# Altium schematic sheet IGresupply.SchDoc
size A3
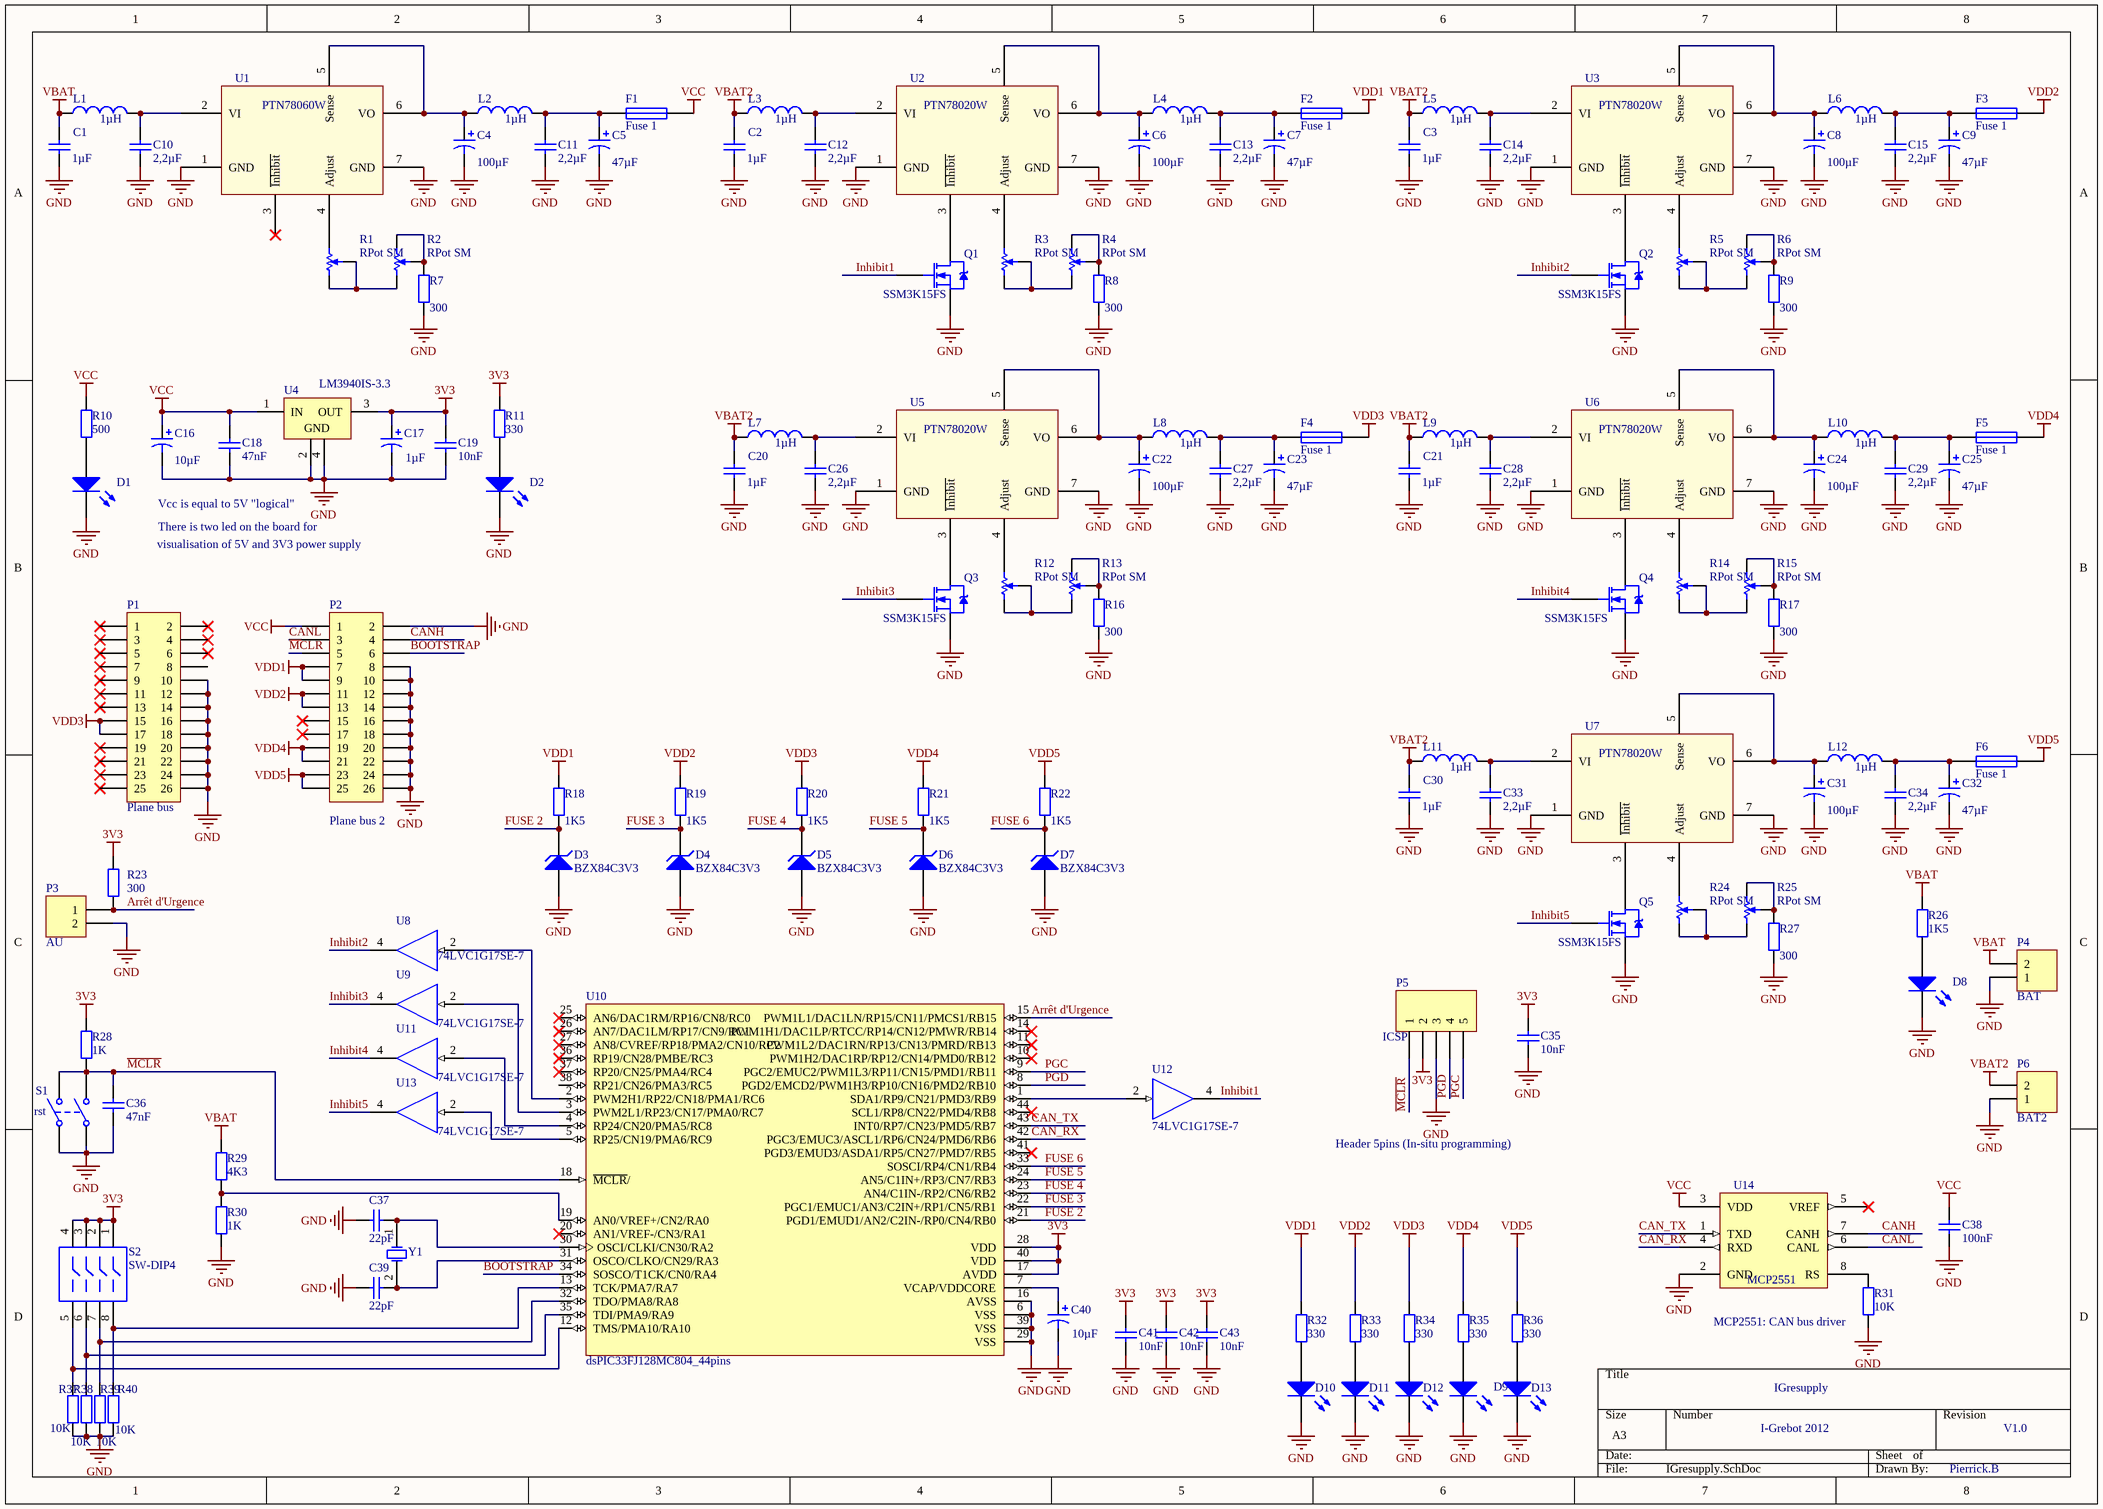
[diagram p0: IGresupply.SchDoc]

## Parts
C1  value 1µF  [Boitier tantale A]  (hidden comment: Cap)
C2  value 1µF  [Boitier tantale A]  (hidden comment: Cap)
C3  value 1µF  [Boitier tantale A]  (hidden comment: Cap)
C4  value 100µF  [Boitier tantale C]  (hidden comment: Cap Pol)
C5  value 47µF  [Boitier tantale C]  (hidden comment: Cap Pol)
C6  value 100µF  [Boitier tantale C]  (hidden comment: Cap Pol)
C7  value 47µF  [Boitier tantale C]  (hidden comment: Cap Pol)
C8  value 100µF  [Boitier tantale C]  (hidden comment: Cap Pol)
C9  value 47µF  [Boitier tantale C]  (hidden comment: Cap Pol)
C10  value 2,2µF  [Boitier tantale A]  (hidden comment: Cap)
C11  value 2,2µF  [Boitier tantale A]  (hidden comment: Cap)
C12  value 2,2µF  [Boitier tantale A]  (hidden comment: Cap)
C13  value 2,2µF  [Boitier tantale A]  (hidden comment: Cap)
C14  value 2,2µF  [Boitier tantale A]  (hidden comment: Cap)
C15  value 2,2µF  [Boitier tantale A]  (hidden comment: Cap)
C16  value 10µF  [Boitier tantale A]  (hidden comment: Cap Pol)
C17  value 1µF  [Boitier tantale A]  (hidden comment: Cap Pol)
C18  value 47nF  [C0603]  (hidden comment: Cap)
C19  value 10nF  [C0603]  (hidden comment: Cap)
C20  value 1µF  [Boitier tantale A]  (hidden comment: Cap)
C21  value 1µF  [Boitier tantale A]  (hidden comment: Cap)
C22  value 100µF  [Boitier tantale C]  (hidden comment: Cap Pol)
C23  value 47µF  [Boitier tantale C]  (hidden comment: Cap Pol)
C24  value 100µF  [Boitier tantale C]  (hidden comment: Cap Pol)
C25  value 47µF  [Boitier tantale C]  (hidden comment: Cap Pol)
C26  value 2,2µF  [Boitier tantale A]  (hidden comment: Cap)
C27  value 2,2µF  [Boitier tantale A]  (hidden comment: Cap)
C28  value 2,2µF  [Boitier tantale A]  (hidden comment: Cap)
C29  value 2,2µF  [Boitier tantale A]  (hidden comment: Cap)
C30  value 1µF  [Boitier tantale A]  (hidden comment: Cap)
C31  value 100µF  [Boitier tantale C]  (hidden comment: Cap Pol)
C32  value 47µF  [Boitier tantale C]  (hidden comment: Cap Pol)
C33  value 2,2µF  [Boitier tantale A]  (hidden comment: Cap)
C34  value 2,2µF  [Boitier tantale A]  (hidden comment: Cap)
C35  value 10nF  [C0603]  (hidden comment: Cap)
C36  value 47nF  [C0603]  (hidden comment: Cap)
C37  value 22pF  [C0603]  (hidden comment: Cap)
C38  value 100nF  [C0603]  (hidden comment: Cap)
C39  value 22pF  [C0603]  (hidden comment: Cap)
C40  value 10µF  [Boitier tantale A]  (hidden comment: Cap Pol)
C41  value 10nF  [C0603]  (hidden comment: Cap)
C42  value 10nF  [C0603]  (hidden comment: Cap)
C43  value 10nF  [C0603]  (hidden comment: Cap)
D1  LED1  [HSMS-C110]  (value not drawn)
D2  LED1  [HSMS-C110]  (value not drawn)
D3  BZX84C3V3  [SOT-23]
D4  BZX84C3V3  [SOT-23]
D5  BZX84C3V3  [SOT-23]
D6  BZX84C3V3  [SOT-23]
D7  BZX84C3V3  [SOT-23]
D8  LED1  [HSMS-C110]  (value not drawn)
D9  LED1  [HSMS-C110]  (value not drawn)
D10  LED1  [HSMS-C110]  (value not drawn)
D11  LED1  [HSMS-C110]  (value not drawn)
D12  LED1  [HSMS-C110]  (value not drawn)
D13  LED1  [HSMS-C110]  (value not drawn)
F1  Fuse 1  [MCCQ-122]
F2  Fuse 1  [MCCQ-122]
F3  Fuse 1  [MCCQ-122]
F4  Fuse 1  [MCCQ-122]
F5  Fuse 1  [MCCQ-122]
F6  Fuse 1  [MCCQ-122]
L1  value 1µH  [744772010]  (hidden comment: Inductor)
L2  value 1µH  [744772010]  (hidden comment: Inductor)
L3  value 1µH  [744772010]  (hidden comment: Inductor)
L4  value 1µH  [744772010]  (hidden comment: Inductor)
L5  value 1µH  [744772010]  (hidden comment: Inductor)
L6  value 1µH  [744772010]  (hidden comment: Inductor)
L7  value 1µH  [744772010]  (hidden comment: Inductor)
L8  value 1µH  [744772010]  (hidden comment: Inductor)
L9  value 1µH  [744772010]  (hidden comment: Inductor)
L10  value 1µH  [744772010]  (hidden comment: Inductor)
L11  value 1µH  [744772010]  (hidden comment: Inductor)
L12  value 1µH  [744772010]  (hidden comment: Inductor)
P1  Plane bus  [HDR2X13H]
P2  Plane bus 2  [HDR2X13H]
P3  AU  [SL 5.08/90]
P4  BAT  [SL 5.08/90]
P5  ICSP  [HDR1X5]
P6  BAT2  [SL 5.08/90]
Q1  SSM3K15FS  [SOT-23]
Q2  SSM3K15FS  [SOT-23]
Q3  SSM3K15FS  [SOT-23]
Q4  SSM3K15FS  [SOT-23]
Q5  SSM3K15FS  [SOT-23]
R1  RPot SM  [3296X]
R2  RPot SM  [3296X]
R3  RPot SM  [3296X]
R4  RPot SM  [3296X]
R5  RPot SM  [3296X]
R6  RPot SM  [3296X]
R7  value 300  [0805]  (hidden comment: Res2)
R8  value 300  [0805]  (hidden comment: Res2)
R9  value 300  [0805]  (hidden comment: Res2)
R10  value 500  [0805]  (hidden comment: Res2)
R11  value 330  [0805]  (hidden comment: Res2)
R12  RPot SM  [3296X]
R13  RPot SM  [3296X]
R14  RPot SM  [3296X]
R15  RPot SM  [3296X]
R16  value 300  [0805]  (hidden comment: Res2)
R17  value 300  [0805]  (hidden comment: Res2)
R18  value 1K5  [0805]  (hidden comment: Res2)
R19  value 1K5  [0805]  (hidden comment: Res2)
R20  value 1K5  [0805]  (hidden comment: Res2)
R21  value 1K5  [0805]  (hidden comment: Res2)
R22  value 1K5  [0805]  (hidden comment: Res2)
R23  value 300  [0805]  (hidden comment: Res2)
R24  RPot SM  [3296X]
R25  RPot SM  [3296X]
R26  value 1K5  [0805]  (hidden comment: Res2)
R27  value 300  [0805]  (hidden comment: Res2)
R28  value 1K  [0805]  (hidden comment: Res2)
R29  value 4K3  [0805]  (hidden comment: Res2)
R30  value 1K  [0805]  (hidden comment: Res2)
R31  value 10K  [0805]  (hidden comment: Res2)
R32  value 330  [0805]  (hidden comment: Res2)
R33  value 330  [0805]  (hidden comment: Res2)
R34  value 330  [0805]  (hidden comment: Res2)
R35  value 330  [0805]  (hidden comment: Res2)
R36  value 330  [0805]  (hidden comment: Res2)
R37  value 10K  [0603]  (hidden comment: Res2)
R38  value 10K  [0603]  (hidden comment: Res2)
R39  value 10K  [0603]  (hidden comment: Res2)
R40  value 10K  [0603]  (hidden comment: Res2)
S1  rst  [Bouton poussoir]
S2  SW-DIP4  [DIP-8]
U1  PTN78060W  [EUW]
U2  PTN78020W  [EUK]
U3  PTN78020W  [EUK]
U4  LM3940IS-3.3  [SOT223]
U5  PTN78020W  [EUK]
U6  PTN78020W  [EUK]
U7  PTN78020W  [EUK]
U8  74LVC1G17SE-7  [DBV]
U9  74LVC1G17SE-7  [DBV]
U10  dsPIC33FJ128MC804_44pins  [TQFP-44]
U11  74LVC1G17SE-7  [DBV]
U12  74LVC1G17SE-7  [DBV]
U13  74LVC1G17SE-7  [DBV]
U14  MCP2551  [SOIC150-8]
Y1  XTAL  [HC49US]  (value not drawn)

## Nets
3V3: C17.1 C19.2 C35.2 C41.2 C42.2 C43.2 P5.2 R11.2 R23.2 R28.2 S2.1 S2.2 S2.3 S2.4 U4.3(OUT) U10.17(AVDD) U10.28(VDD) U10.40(VDD)
GND: C1.1 C2.1 C3.1 C4.2 C5.2 C6.2 C7.2 C8.2 C9.2 C10.1 C11.1 C12.1 C13.1 C14.1 C15.1 C16.2 C17.2 C18.1 C19.1 C20.1 C21.1 C22.2 C23.2 C24.2 C25.2 C26.1 C27.1 C28.1 C29.1 C30.1 C31.2 C32.2 C33.1 C34.1 C35.1 C36.1 C37.1 C38.1 C39.1 C40.2 C41.1 C42.1 C43.1 D1.2(K) D2.2(K) D3.1(A) D4.1(A) D5.1(A) D6.1(A) D7.1(A) D8.2(K) D9.2(K) D10.2(K) D11.2(K) D12.2(K) D13.2(K) P1.10 P1.12 P1.14 P1.16 P1.18 P1.20 P1.22 P1.24 P1.26 P2.2 P2.8 P2.10 P2.12 P2.14 P2.16 P2.18 P2.20 P2.22 P2.24 P2.26 P3.2 P4.1 P5.3 P6.1 Q1.3(S) Q2.3(S) Q3.3(S) Q4.3(S) Q5.3(S) R7.1 R8.1 R9.1 R16.1 R17.1 R27.1 R30.1 R31.1 R37.1 R38.1 R39.1 R40.1 S1.1(COMMON1) S1.3(COMMON2) U1.1(GND) U1.7(GND) U2.1(GND) U2.7(GND) U3.1(GND) U3.7(GND) U4.2(GND) U4.4(GND) U5.1(GND) U5.7(GND) U6.1(GND) U6.7(GND) U7.1(GND) U7.7(GND) U8.3(GND) U9.3(GND) U10.6(VSS) U10.16(AVSS) U10.29(VSS) U10.39(VSS) U11.3(GND) U12.3(GND) U13.3(GND) U14.2(GND)
VBAT: C1.2 L1.1 P4.2 R26.2 R29.2
VBAT2: C2.2 C3.2 C20.2 C21.2 C30.2 L3.1 L5.1 L7.1 L9.1 L11.1 P6.2
VCC: C16.1 C18.2 C38.2 F1.2 P2.1 R10.2 U4.1(IN) U8.5(VCC) U9.5(VCC) U11.5(VCC) U12.5(VCC) U13.5(VCC) U14.3(VDD)
VDD1: F2.2 P2.7 P2.9 R18.2 R32.2
VDD2: F3.2 P2.11 P2.13 R19.2 R33.2
VDD3: F4.2 P1.15 P1.17 R20.2 R34.2
VDD4: F5.2 P2.19 P2.21 R21.2 R35.2
VDD5: F6.2 P2.23 P2.25 R22.2 R36.2
Arrêt d'Urgence: P3.1 R23.1 U10.15(PWM1L1/DAC1LN/RP15/CN11/PMCS1/RB15)
BOOTSTRAP: P2.6 U10.34(SOSCO/T1CK/CN0/RA4)
CAN_RX: U10.42(PGC3/EMUC3/ASCL1/RP6/CN24/PMD6/RB6) U14.4(RXD)
CAN_TX: U10.43(INT0/RP7/CN23/PMD5/RB7) U14.1(TXD)
CANH: P2.4 U14.7(CANH)
CANL: P2.3 U14.6(CANL)
FUSE 2: D3.3(K) R18.1 U10.21(PGD1/EMUD1/AN2/C2IN-/RP0/CN4/RB0)
FUSE 3: D4.3(K) R19.1 U10.22(PGC1/EMUC1/AN3/C2IN+/RP1/CN5/RB1)
FUSE 4: D5.3(K) R20.1 U10.23(AN4/C1IN-/RP2/CN6/RB2)
FUSE 5: D6.3(K) R21.1 U10.24(AN5/C1IN+/RP3/CN7/RB3)
FUSE 6: D7.3(K) R22.1 U10.33(SOSCI/RP4/CN1/RB4)
Inhibit1: Q1.1(G) U12.4(Y)
Inhibit2: Q2.1(G) U8.4(Y)
Inhibit3: Q3.1(G) U9.4(Y)
Inhibit4: Q4.1(G) U11.4(Y)
Inhibit5: Q5.1(G) U13.4(Y)
~{MCLR}: C36.2 P2.5 P5.1 R28.1 S1.2(NO1) S1.4(NO2) U10.18(~{MCLR}/)
PGC: P5.5 U10.9(PGC2/EMUC2/PWM1L3/RP11/CN15/PMD1/RB11)
PGD: P5.4 U10.8(PGD2/EMCD2/PWM1H3/RP10/CN16/PMD2/RB10)
NetC4_1: C4.1 L2.1 U1.5(Sense) U1.6(VO)
NetC5_1: C5.1 C11.2 F1.1 L2.2
NetC6_1: C6.1 L4.1 U2.5(Sense) U2.6(VO)
NetC7_1: C7.1 C13.2 F2.1 L4.2
NetC8_1: C8.1 L6.1 U3.5(Sense) U3.6(VO)
NetC9_1: C9.1 C15.2 F3.1 L6.2
NetC10_2: C10.2 L1.2 U1.2(VI)
NetC12_2: C12.2 L3.2 U2.2(VI)
NetC14_2: C14.2 L5.2 U3.2(VI)
NetC22_1: C22.1 L8.1 U5.5(Sense) U5.6(VO)
NetC23_1: C23.1 C27.2 F4.1 L8.2
NetC24_1: C24.1 L10.1 U6.5(Sense) U6.6(VO)
NetC25_1: C25.1 C29.2 F5.1 L10.2
NetC26_2: C26.2 L7.2 U5.2(VI)
NetC28_2: C28.2 L9.2 U6.2(VI)
NetC31_1: C31.1 L12.1 U7.5(Sense) U7.6(VO)
NetC32_1: C32.1 C34.2 F6.1 L12.2
NetC33_2: C33.2 L11.2 U7.2(VI)
NetC37_2: C37.2 U10.30(OSCI/CLKI/CN30/RA2) Y1.1(OSC1)
NetC39_2: C39.2 U10.31(OSCO/CLKO/CN29/RA3) Y1.2(OSC2)
NetC40_1: C40.1 U10.7(VCAP/VDDCORE)
NetD1_1: D1.1(A) R10.1
NetD2_1: D2.1(A) R11.1
NetD8_1: D8.1(A) R26.1
NetD9_1: D9.1(A) R35.1
NetD10_1: D10.1(A) R32.1
NetD11_1: D11.1(A) R33.1
NetD12_1: D12.1(A) R34.1
NetD13_1: D13.1(A) R36.1
NetQ1_2: Q1.2(D) U2.3(~{Inhibit})
NetQ2_2: Q2.2(D) U3.3(~{Inhibit})
NetQ3_2: Q3.2(D) U5.3(~{Inhibit})
NetQ4_2: Q4.2(D) U6.3(~{Inhibit})
NetQ5_2: Q5.2(D) U7.3(~{Inhibit})
NetR1_1: R1.1(-) R1.2(W) R2.1(-)
NetR1_3: R1.3(+) U1.4(Adjust)
NetR2_2: R2.2(W) R2.3(+) R7.2
NetR3_1: R3.1(-) R3.2(W) R4.1(-)
NetR3_3: R3.3(+) U2.4(Adjust)
NetR4_2: R4.2(W) R4.3(+) R8.2
NetR5_1: R5.1(-) R5.2(W) R6.1(-)
NetR5_3: R5.3(+) U3.4(Adjust)
NetR6_2: R6.2(W) R6.3(+) R9.2
NetR12_1: R12.1(-) R12.2(W) R13.1(-)
NetR12_3: R12.3(+) U5.4(Adjust)
NetR13_2: R13.2(W) R13.3(+) R16.2
NetR14_1: R14.1(-) R14.2(W) R15.1(-)
NetR14_3: R14.3(+) U6.4(Adjust)
NetR15_2: R15.2(W) R15.3(+) R17.2
NetR24_1: R24.1(-) R24.2(W) R25.1(-)
NetR24_3: R24.3(+) U7.4(Adjust)
NetR25_2: R25.2(W) R25.3(+) R27.2
NetR29_1: R29.1 R30.2 U10.19(AN0/VREF+/CN2/RA0)
NetR31_2: R31.2 U14.8(RS)
NetR37_2: R37.2 S2.5 U10.12(TMS/PMA10/RA10)
NetR38_2: R38.2 S2.6 U10.35(TDI/PMA9/RA9)
NetR39_2: R39.2 S2.7 U10.32(TDO/PMA8/RA8)
NetR40_2: R40.2 S2.8 U10.13(TCK/PMA7/RA7)
NetU8_2: U8.2(A) U10.2(PWM2H1/RP22/CN18/PMA1/RC6)
NetU9_2: U9.2(A) U10.3(PWM2L1/RP23/CN17/PMA0/RC7)
NetU10_1: U10.1(SDA1/RP9/CN21/PMD3/RB9) U12.2(A)
NetU10_4: U10.4(RP24/CN20/PMA5/RC8) U11.2(A)
NetU10_5: U10.5(RP25/CN19/PMA6/RC9) U13.2(A)

Not connected (* = marked no-connect by the designer): P1 1* 2* 3* 4* 5* 6* 7* 8 9* 11* 13* 19* 21* 23* 25*; P2 15* 17*; U1 3(~{Inhibit})*; U10 10(PWM1H2/DAC1RP/RP12/CN14/PMD0/RB12)* 11(PWM1L2/DAC1RN/RP13/CN13/PMRD/RB13)* 14(PWM1H1/DAC1LP/RTCC/RP14/CN12/PMWR/RB14)* 20(AN1/VREF-/CN3/RA1)* 25(AN6/DAC1RM/RP16/CN8/RC0)* 26(AN7/DAC1LM/RP17/CN9/RC1)* 27(AN8/CVREF/RP18/PMA2/CN10/RC2)* 36(RP19/CN28/PMBE/RC3)* 37(RP20/CN25/PMA4/RC4)* 38(RP21/CN26/PMA3/RC5) 41(PGD3/EMUD3/ASDA1/RP5/CN27/PMD7/RB5)* 44(SCL1/RP8/CN22/PMD4/RB8)*; U14 5(VREF)*

## Notes on the sheet
- Vcc is equal to 5V "logical"
- visualisation of 5V and 3V3 power supply
- There is two led on the board for
- Header 5pins (In-situ programming)
- (near R31) MCP2551: CAN bus driver
- IGresupply
- I-Grebot 2012
- V1.0
- Pierrick.B

## Library data of the parts
C1-C3 C10-C15 C18-C21 C26-C30 C33-C39 C41-C43 = Cap: Capacitor; Published: 8-Jun-2000; LatestRevisionDate: 17-Jul-2002; LatestRevisionNote: Re-released for DXP Platform.; PackageReference: RAD-0.3; Publisher: Altium Limited
  C1-C3 C10-C15 C20 C21 C26-C30 C33 C34: Supplier: FARNELL
C4-C9 C16 C17 C22-C25 C31 C32 C40 = Cap Pol: Polarized Capacitor; Published: 8-Jun-2000; LatestRevisionDate: 17-Jul-2002; LatestRevisionNote: Re-released for DXP Platform.; PackageReference: POLAR0.8; Publisher: Altium Limited
  C4-C9 C22-C25 C31 C32: Supplier: FARNELL
D1 D2 D8-D13 = LED1: Typical RED GaAs LED; Published: 8-Jun-2000; LatestRevisionDate: 08-Jul-2005; LatestRevisionNote: Mech Layer 1 removed.; PackageReference: LED-1; Publisher: Altium Limited
D3-D7 = D Zener: Zener Diode; Published: 8-Jun-2000; LatestRevisionDate: 17-Jul-2002; LatestRevisionNote: Re-released for DXP Platform.; PackageReference: DIODE-0.7; Publisher: Altium Limited
F1-F6 = Fuse 1: Fuse; Published: 8-Jun-2000; LatestRevisionDate: 17-Jul-2002; LatestRevisionNote: Re-released for DXP Platform.; PackageReference: PIN-W2/E2.8; Publisher: Altium Limited
L1-L12 = Inductor: Code_IEC: 1005; Published: 8-Jun-2000; LatestRevisionDate: 17-Jul-2002; LatestRevisionNote: Re-released for DXP Platform.; PackageReference: 0402-A; Publisher: Altium Limited; Code_JEITA: 0402
P1 P2 = Header 13X2H: Header, 13-Pin, Dual row, Right Angle; LatestRevisionDate: 17-Jul-2002; LatestRevisionNote: Re-released for DXP Platform.; Publisher: Altium Limited
P3 P4 P6 = 0436500203: Micro-Fit, 3.0; LatestRevisionDate: 17-Jul-2002; LatestRevisionNote: Re-released for DXP Platform.; Publisher: Altium Limited
P5 = Header 5: Header, 5-Pin; LatestRevisionDate: 17-Jul-2002; LatestRevisionNote: Re-released for DXP Platform.; Publisher: Altium Limited
Q1-Q5 = NMOS-2: N-Channel Power MOSFET; Note: Pin 2 is electrically connected to pin 4.; Published: 8-Jun-2000; LatestRevisionDate: 17-Jul-2002; LatestRevisionNote: Re-released for DXP Platform.; DatasheetDocument: PD-9.814; PackageReference: TO-220AB; Publisher: Altium Limited; Code_JEDEC: TO-220-AB; ComponentLink1Description: Manufacturer Link; ComponentLink1URL: http://www.irf.com/
R1-R6 R12-R15 R24 R25 = RPot SM: Square Trimming Potentiometer; Published: 17-Dec-2003; DatasheetDocument: Oct-2003; PackageReference: POT4MM-2; Publisher: Altium Limited; ComponentLink1Description: Manufacturer Link; ComponentLink1URL: http://bourns.com/2/search.html
R7-R11 R16-R23 R26-R40 = Res2: Resistor; Published: 8-Jun-2000; LatestRevisionDate: 17-Jul-2002; LatestRevisionNote: Re-released for DXP Platform.; PackageReference: AXIAL-0.4; Publisher: Altium Limited
  R7-R9 R16-R23 R27: Supplier: FARNELL
S1 = SW-DPST: Double-Pole, Single-Throw Switch; Published: 24-Mar-1999; LatestRevisionDate: 17-Jul-2002; LatestRevisionNote: Re-released for DXP Platform.; PackageReference: DPST-4; Publisher: Altium Limited
S2 = SW-DIP4: DIP Switch; Published: 24-Mar-1999; LatestRevisionDate: 17-Jul-2002; LatestRevisionNote: Re-released for DXP Platform.; PackageReference: DIP-8; Publisher: Altium Limited
U4 = LM3940IS-3.3: 1A Low-Dropout Regulator For 5V to 3.3V Conversion; Note: Tab is connected to GND; Published: 15-Apr-2002; DatasheetDocument: Apr-1998; PackageReference: TS3B; Publisher: Altium Limited; ComponentLink1Description: Manufacturer Link; ComponentLink1URL: http://www.national.com/; ComponentLink2Description: Datasheet; ComponentLink2URL: http://www.national.com/ds.cgi/LM/LM3940.pdf; ComponentLink3Description: URL Link1; ComponentLink3URL: http://www.national.com/pf/LM/LM3940.html
U8 U9 U11-U13 = 74LVC1G17SE-7: SINGLE BUS BUFFER GATE  WITH 3-STATE OUTPUT; PackageDocument: 2000; Published: 15-Apr-2002; LatestRevisionDate: 06-Jun-2005; LatestRevisionNote: Stylized 3D Model Added.; DatasheetDocument: Jun-1989; PackageReference: N14A; Publisher: Altium Limited; ComponentLink1Description: Manufacturer Link; ComponentLink1URL: http://www.national.com/; ComponentLink2Description: Datasheet; ComponentLink2URL: http://www.national.com/ds.cgi/DM/DM54125.pdf; ComponentLink3Description: URL Link1; ComponentLink3URL: http://www.national.com/pf/DM/DM54125.html
U14 = MCP2551: High Speed Can Transceiver; Published: 6-Oct-2005; DatasheetDocument: Nov-2003; PackageDocument: Oct-2005; PackageReference: SOIC150-8; Publisher: Altium Limited; Code_JEDEC: MS-012; ComponentLink1Description: Manufacturer Link; ComponentLink1URL: http://www.microchip.com; ComponentLink2Description: Datasheet; ComponentLink2URL: http://ww1.microchip.com/downloads/en/DeviceDoc/21667d.pdf
Y1 = XTAL: Crystal Oscillator; Published: 8-Jun-2000; LatestRevisionDate: 17-Jul-2002; LatestRevisionNote: Re-released for DXP Platform.; PackageReference: R38; Publisher: Altium Limited
U10 = dsPIC33FJ128MC804_44pins: LatestRevisionDate: 10-Feb-2009; PackageReference: TQFP-44; Supplier name: FARNELL; Supplier code: *